# Altium schematic sheet Mini_System.SchDoc
size A4
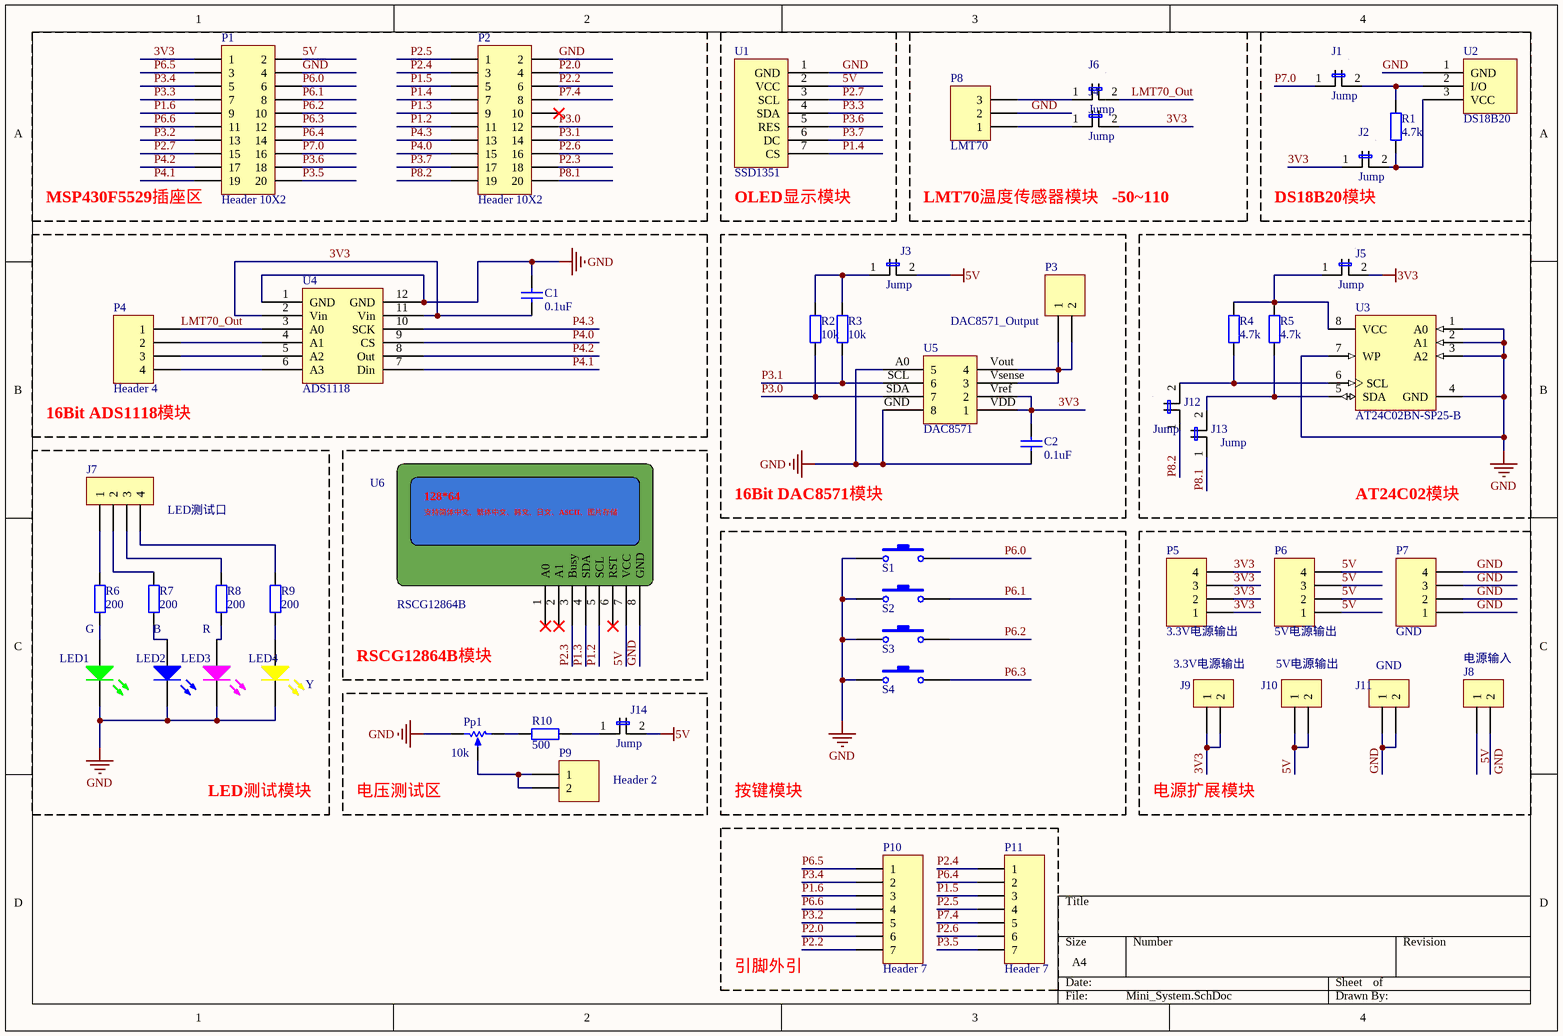
[diagram p0: Mini_System.SchDoc]

## Parts
C1  0.1uF  [Capacitor-Disk-Middle]
C2  0.1uF  [Capacitor-Disk-Middle]
J1  Jump  [HDR-1x2]
J2  Jump  [HDR-1x2]
J3  Jump  [HDR-1x2]
J4  Jump  [HDR-1x2]
J5  Jump  [HDR-1x2]
J6  Jump  [HDR-1x2]
J7  LED测试口  [HDR-1X4_M]
J8  电源输入  [XH2.54-2P]
J9  3.3V电源输出  [WJ500V-5.08-2]
J10  5V电源输出  [WJ500V-5.08-2]
J11  GND  [WJ500V-5.08-2]
J12  Jump  [HDR-1x2]
J13  Jump  [HDR-1x2]
J14  Jump  [HDR-1x2]
LED1  G  [LED-R3-H5-SINGLE-G]
LED2  B  [LED-R3-H5-SINGLE-B]
LED3  R  [LED-R3-H5-SINGLE-R]
LED4  Y  [LED-R3-H5-SINGLE-Y]
P1  Header 10X2  [HDR2X10]
P2  Header 10X2  [HDR2X10]
P3  DAC8571_Output  [HDR-1X2_H]
P4  Header 4  [HDR1X4]
P5  3.3V电源输出  [HDR1X4]
P6  5V电源输出  [HDR1X4]
P7  GND  [HDR1X4]
P8  LMT70  [HDR-1X3_M]
P9  Header 2  [HDR1X2]
P10  Header 7  [HDR-1X7_M]
P11  Header 7  [HDR-1X7_M]
Pp1  10k  [RP_3296]
R1  4.7k  [RS 1/4W]
R2  10k  [RS 1/4W]
R3  10k  [RS 1/4W]
R4  4.7k  [RS 1/4W]
R5  4.7k  [RS 1/4W]
R6  200  [RS 1/4W]
R7  200  [RS 1/4W]
R8  200  [RS 1/4W]
R9  200  [RS 1/4W]
R10  500  [RS 1/4W]
S1  S1  [BUTTON_6*6]
S2  S2  [BUTTON_6*6]
S3  S3  [BUTTON_6*6]
S4  S4  [BUTTON_6*6]
U1  SSD1351  [HDR-1X7_M]
U2  DS18B20  [HDR-1X3_Y]
U3  AT24C02BN-SP25-B  [DIP8-300_MH]
U4  ADS1118  [dip12]
U5  DAC8571  [DIP8-300_MH]
U6  RSCG12864B  [HDR-1X8_M]

## Blocks framed on the sheet
MSP430F5529插座区: P1 P2
OLED显示模块: U1
LMT70温度传感器模块   -50~110: J4 J6 P8
DS18B20模块: J1 J2 R1 U2
16Bit ADS1118模块: C1 P4 U4
16Bit DAC8571模块: C2 J3 P3 R2 R3 U5
AT24C02模块: J5 J12 J13 R4 R5 U3
LED测试模块: J7 LED1-LED4 R6-R9
RSCG12864B模块: U6
按键模块: S1-S4
电源扩展模块: J8-J11 P5-P7
电压测试区: J14 P9 Pp1 R10
引脚外引: P10 P11

## Nets
3V3: C1.1 C2.2 J2.1 J4.2 J5.2 J9.1 J9.2 P1.1 P5.1 P5.2 P5.3 P5.4 U4.2(Vin) U4.11(Vin) U5.VDD(1) U5.Vref(2)
5V: J3.2 J8.1 J10.1 J10.2 J14.2 P1.2 P6.1 P6.2 P6.3 P6.4 U1.2(VCC) U6.7(VCC)
GND: C1.2 C2.1 J8.2 J11.1 J11.2 LED1.2(K) LED2.2(K) LED3.2(K) LED4.2(K) P1.4 P2.2 P7.1 P7.2 P7.3 P7.4 P8.2 Pp1.3(BOT) S1.1 S2.1 S3.1 S4.1 U1.1(GND) U2.1(GND) U3.1(A0) U3.2(A1) U3.3(A2) U3.4(GND) U3.7(WP) U4.1(GND) U4.12(GND) U5.A0(5) U5.GND(8) U6.8(GND)
LMT70_Out: J6.2 P4.1 U4.3(A0)
P1.2: P2.11 U6.5(SCL)
P1.3: P2.9 U6.4(SDA)
P1.4: P2.7 U1.7(CS)
P1.5: P2.5 P11.3
P1.6: P1.9 P10.3
P2.0: P2.4 P10.6
P2.2: P2.6 P10.7
P2.3: P2.18 U6.3(Busy)
P2.4: P2.3 P11.1
P2.5: P2.1 P11.4
P2.6: P2.16 P11.6
P2.7: P1.15 U1.3(SCL)
P3.0: P2.12 R2.1 U5.SDA(7)
P3.1: P2.14 R3.1 U5.SCL(6)
P3.2: P1.13 P10.5
P3.3: P1.7 U1.4(SDA)
P3.4: P1.5 P10.2
P3.5: P1.20 P11.7
P3.6: P1.18 U1.5(RES)
P3.7: P2.17 U1.6(DC)
P4.0: P2.15 U4.9(CS)
P4.1: P1.19 U4.7(Din)
P4.2: P1.17 U4.8(Out)
P4.3: P2.13 U4.10(SCK)
P6.0: P1.6 S1.2
P6.1: P1.8 S2.2
P6.2: P1.10 S3.2
P6.3: P1.12 S4.2
P6.4: P1.14 P11.2
P6.5: P1.3 P10.1
P6.6: P1.11 P10.4
P7.0: J1.1 P1.16
P7.4: P2.8 P11.5
P8.1: J13.1 P2.20
P8.2: J12.1 P2.19
NetJ1_2: J1.2 R1.2 U2.2(I/O)
NetJ2_2: J2.2 R1.1 U2.3(VCC)
NetJ3_1: J3.1 R2.2 R3.2
NetJ4_1: J4.1 P8.1
NetJ5_1: J5.1 R4.2 R5.2 U3.8(VCC)
NetJ6_1: J6.1 P8.3
NetJ7_1: J7.1 R6.2
NetJ7_2: J7.2 R7.2
NetJ7_3: J7.3 R8.2
NetJ7_4: J7.4 R9.2
NetJ12_2: J12.2 R4.1 U3.6(SCL)
NetJ13_2: J13.2 R5.1 U3.5(SDA)
NetJ14_1: J14.1 R10.1
NetLED1_1: LED1.1(A) R6.1
NetLED2_1: LED2.1(A) R7.1
NetLED3_1: LED3.1(A) R8.1
NetLED4_1: LED4.1(A) R9.1
NetP3_1: P3.1 P3.2 U5.Vout(4) U5.Vsense(3)
NetP4_2: P4.2 U4.4(A1)
NetP4_3: P4.3 U4.5(A2)
NetP4_4: P4.4 U4.6(A3)
NetP9_1: P9.1 P9.2 Pp1.2(TAP)
NetPp1_1: Pp1.1(TOP) R10.2

Not connected (* = marked no-connect by the designer): P2 10*; U6 1(A0)* 2(A1)* 6(RST)*

## Notes on the sheet
- (in symbol RSCG12864B) 128*64; 支持简体中文、繁体中文、韩文、日文、ASCII、图片存储

## Library data of the parts
C1 C2 = Cap Nicklon: CBB聚乙烯薄膜电容; Value: 100nF; Voltage: 63V; Published: 8-Jun-2000; Revision: July-2002: Re-released for DXP Platform.; Publisher: Altium Limited; 实物样品照片: https://item.taobao.com/item.htm?spm=a230r.1.14.32.21fd24b7VWml4d&id=37914290992&ns=1&abbucket=13#detail
J7 = HDR1X4: 排针; ComponentLink1URL: http://www.szlcsc.com/product/details_58403.html; price: 0.2; Supplier: LC; SuppliersPartNumber: C57369; Manufacturer: *; ComponentLink1Description: 供应商链接
J8 = CON2: 连接器
J9-J11 = KF128-5.08MM-2P: 接线端子; ComponentLink1URL: https://detail.tmall.com/item.htm?spm=a1z10.5-b.w4011-14865958799.193.B0p41N&id=45905508377&rn=e90e7252b5175cd006380c5c01151190&abbucket=9; price: 0.5; Supplier: Farpu; SuppliersPartNumber: *; Manufacturer: *; ComponentLink1Description: 供应商链接
LED1 = LED-3-G: Typical INFRARED GaAs LED; Published: 8-Jun-2000; Revision: July-2002: Re-released for DXP Platform.; Publisher: Altium Limited
LED2 = LED-3-B: Typical INFRARED GaAs LED; Published: 8-Jun-2000; Revision: July-2002: Re-released for DXP Platform.; Publisher: Altium Limited
LED3 = LED-3-R: Typical INFRARED GaAs LED; Published: 8-Jun-2000; Revision: July-2002: Re-released for DXP Platform.; Publisher: Altium Limited
LED4 = LED-3-Y: Typical INFRARED GaAs LED; Published: 8-Jun-2000; Revision: July-2002: Re-released for DXP Platform.; Publisher: Altium Limited
P1 P2 = Header 10X2: Header, 10-Pin, Dual row; LatestRevisionDate: 17-Jul-2002; LatestRevisionNote: Re-released for DXP Platform.; Publisher: Altium Limited
P3 P9 = Header 2: Header, 2-Pin; LatestRevisionDate: 17-Jul-2002; LatestRevisionNote: Re-released for DXP Platform.; Publisher: Altium Limited
P4-P7 = Header 4: Header, 4-Pin; LatestRevisionDate: 17-Jul-2002; LatestRevisionNote: Re-released for DXP Platform.; Publisher: Altium Limited
P8 = Header 3: Header, 3-Pin; LatestRevisionDate: 17-Jul-2002; LatestRevisionNote: Re-released for DXP Platform.; Publisher: Altium Limited
P10 P11 = Header 7: Header, 7-Pin; LatestRevisionDate: 17-Jul-2002; LatestRevisionNote: Re-released for DXP Platform.; Publisher: Altium Limited
Pp1 = RP_3296: 3296电位器; 购买链接: https://item.taobao.com/item.htm?spm=a230r.1.14.90.21641e34zQj3ul&id=19303265869&ns=1&abbucket=13#detail
R1-R10 = Res2: Resistor; Value: 1K; Published: 8-Jun-2000; LatestRevisionDate: 17-Jul-2002; LatestRevisionNote: Re-released for DXP Platform.; PackageReference: AXIAL-0.4; Publisher: Altium Limited; PackageDescription: Axial Device, Thru-Hole; 2 Leads; 0.4 in Pin Spacing
S1-S4 = SW-PB: Tactile Switch触觉开关; Published: 24-Mar-1999; LatestRevisionDate: 17-Jul-2002; LatestRevisionNote: Re-released for DXP Platform.; PackageReference: SPST-2; Publisher: Altium Limited
U1 = 1.5'OLED RGB SSD1351: 1.5寸彩色OLED
U3 = AT24C02BN-SP25-B: 2Kbit (256 x 8), 2-wire Bus Automotive Serial EEPROM with full memory Write Protect, 2.5V, 8-Pin SOIC, Bulk; Published: 20-Sep-2010; DatasheetVersion: 8517C,  Jan-2009; PackageVersion: revC, Mar-2005; PackageReference: 8S1; Publisher: Altium Limited; PackageDescription: 8-Lead (0.150" Wide Body), Plastic Gull Wing Small Outline (JEDEC SOIC); Code_JEDEC: MS-012-AA; Code_IPC: SOIC127P600-8; ComponentLink1Description: Manufacturer Link; ComponentLink1URL: http://www.atmel.com/products/serial/default.asp; ComponentLink2Description: Datasheet; ComponentLink2URL: http://www.atmel.com/dyn/resources/prod_documents/doc8517.pdf; ComponentLink3Description: Atmel.com Home; ComponentLink3URL: http://www.atmel.com
U4 = ADS1118: 16位ADC芯片，将模拟电压信号转化为数字信号供单片机处理
U5 = DAC8571: 16位DAC芯片，将数字量转化为模拟电压输出; pin to pad: A0>5 GND>8 SCL>6 SDA>7 VDD>1 Vout>4 Vref>2 Vsense>3